# Altium schematic sheet PreCharge.SchDoc
size A4; SheetNumber: 5; SheetTotal: 5
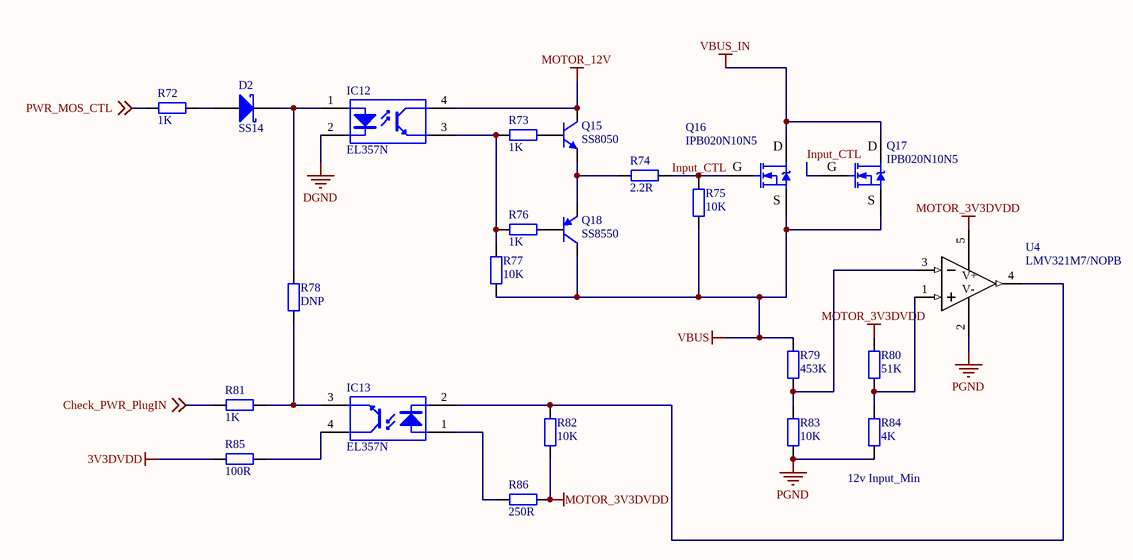
[diagram p0: PreCharge.SchDoc]

## Parts
D2  SS14  [SMA]
IC12  EL357N  [DIP4-300]
IC13  EL357N  [DIP4-300]
Q15  SS8050  [SOT23-3N]
Q16  IPB020N10N5  [TO252]
Q17  IPB020N10N5  [TO252]
Q18  SS8550  [SOT23-3N]
R72  1K  [R 0603_L]
R73  1K  [R 0603_L]
R74  2.2R  [R 0603_L]
R75  10K  [R 0603_L]
R76  1K  [R 0603_L]
R77  10K  [R 0603_L]
R78  DNP  [R 0603_L]
R79  453K  [R 0603_L]
R80  51K  [R 0603_L]
R81  1K  [R 0603_L]
R82  10K  [R 0603_L]
R83  10K  [R 0603_L]
R84  4K  [R 0603_L]
R85  100R  [R 0603_L]
R86  250R  [R 0603_L]
U4  LMV321M7/NOPB  [MAA05A]

## Nets
3V3DVDD: R85.1
DGND: IC12.2(K)
MOTOR_3V3DVDD: R80.1 R82.2 R86.1 U4.5(V+)
MOTOR_12V: IC12.4(C) Q15.3(C)
PGND: R83.2 R84.2 U4.2(V-)
VBUS: Q16.2(S) Q17.2(S) Q18.3(C) R75.2 R77.2 R79.1
VBUS_IN: Q16.3(D) Q17.3(D)
Check_PWR_PlugIN: R81.2 ; off-sheet Check_PWR_PlugIN
Input_CTL: Q16.1(G) Q17.1(G) R74.1 R75.1
PWR_MOS_CTL: R72.2 ; off-sheet PWR_MOS_CTL
NetD2_1: D2.1(A) R72.1
NetD2_2: D2.2(K) IC12.1(A) R78.1
NetIC12_3: IC12.3(E) R73.2 R76.2 R77.1
NetIC13_1: IC13.1(A) R86.2
NetIC13_2: IC13.2(K) R82.1 U4.4(OUT)
NetIC13_3: IC13.3(E) R78.2 R81.1
NetIC13_4: IC13.4(C) R85.2
NetQ15_1: Q15.1(B) R73.1
NetQ15_2: Q15.2(E) Q18.2(E) R74.2
NetQ18_1: Q18.1(B) R76.1
NetR79_2: R79.2 R83.1 U4.3(IN-)
NetR80_2: R80.2 R84.1 U4.1(IN+)

## Notes on the sheet
- (near R84) 12v Input_Min

## Library data of the parts
D2 = SS14: 肖特基二极管; 属性: 40V/1A; BOM名称: 肖特基二极管; 封装库来自淘宝 ID：黄晶宝石: https://shop463601444.taobao.com
IC12 IC13 = EL357N: 线性光耦; 版权归属: 封装库来自淘宝 ID：黄晶宝石; BOM名称: 线性光耦; 学习资源: https://shop463601444.taobao.com
Q15 = 8050-SMD: 高频放大-NPN型; 版权归属: 封装库来自淘宝 ID：黄晶宝石; 属性: 40V 1.5A 1W 100MHZ; BOM名称: 高频放大-NPN型; 联系售后: https://shop463601444.taobao.com
Q16 Q17 = SI2302: N沟道场效应管; BOM名称: N沟道场效应管
Q18 = 8550-SMD: 高频放大-PNP型; 版权归属: 封装库来自淘宝 ID：黄晶宝石; 属性: 40V 1.5A 1W 100MHZ; BOM名称: 高频放大-PNP型; 学习资源: www.ooocke.com
R72-R86 = R: 贴片电阻; BOM名称: 贴片电阻
U4 = LMV321M7/NOPB: No Description Available; Mfr_Name: Texas Instruments; Manufacturer: NationalSemiconductor; Characteristics: LMV321M7GeneralPurposeLowVoltageR-ROut1MHzSingleOpAmpTiny; CompType: OpAmpIC; TaMin_C: -400; TaMax_C: 850; ComponentLink1DescBC: LMV321Datasheet; ComponentLink2DescA4: LMV321WebPage; ComponentLink3DescAC: MAA05APackageWebPage; Copyright: Copyright (C) 2023 Ultra Librarian. All rights reserved.; Manufacturer_Part_Number: LMV321M7/NOPB; Digi-Key_Part_Number_1: LMV321M7/NOPBCT-ND; Digi-Key_Part_Number_2: LMV321M7/NOPBDKR-ND; Digi-Key_Part_Number_3: LMV321M7/NOPBTR-ND; Digi-Key_Part_Number_4: 2156-LMV321M7/NOPB-ND; RefDes: RefDes; Type: DEV; SymbolVersion: 2008-07-09; PartNumber: LMV321M7; PackageDescription: 5LeadSC-70; PackageReference: MAA05A_L; RoHS: O; ComponentLink1URL: http//wwwnationalcom/ds/LM/LMV321pdf; ComponentLink2URL: http//wwwnationalcom/pf/LM/LMV321html; ComponentLink3URL: http//wwwnationalcom/packaging/folders/maa05ahtml; Version: B1608; LatestRevisionDate: 2009-03-16; LatestRevisionNote: MassUpdate; Publisher: NationalSemiconductor; Published: 2009-03-16